# Altium project MB1389.PrjPcb (part 3 of 3)

## Sheet STM32_microcontroller_power.SchDoc: STM32 microcontroller power
size A4; Date: Not used; ApprovedBy: Not used; CheckedBy: Not used; Author: Not used; CompanyName: STMicroelectronics; DrawnBy: Not used; Engineer: Not used; Organization: Not used; Address1: Not used; Address2: Not used; Address3: Not used; Address4: Not used; DocumentNumber: 4; Revision: Not used; SheetNumber: 4; SheetTotal: 8; CurrentTime: Not used; CurrentDate: Not used; Time: Not used; DocumentFullPathAndName: Not used; DocumentName: Not used; ModifiedDate: Not used; ImagePath: Not used; ProjectName: Not used; Application_BuildNumber: Not used
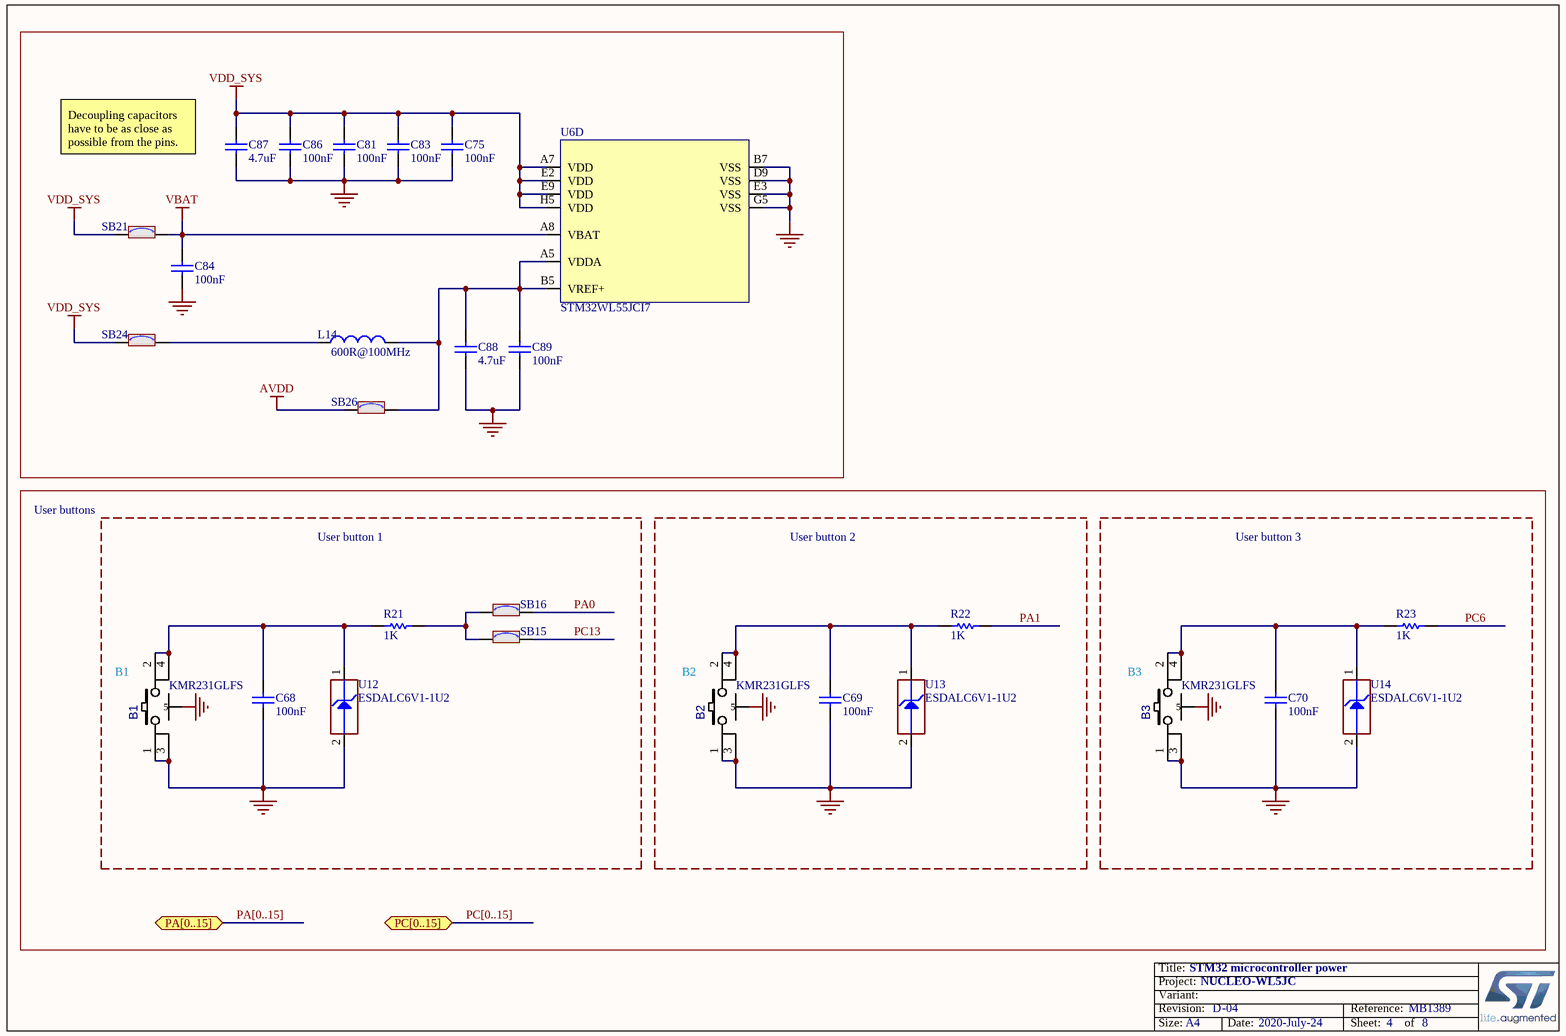
[diagram p7: STM32_microcontroller_power.SchDoc]

### Parts
B1  value KMR231GLFS  [SWI_C&K_Y78B23110FP__ITT_KMR231GLFS]
B2  value KMR231GLFS  [SWI_C&K_Y78B23110FP__ITT_KMR231GLFS]
B3  value KMR231GLFS  [SWI_C&K_Y78B23110FP__ITT_KMR231GLFS]
C68  value 100nF  [C0402]
C69  value 100nF  [C0402]
C70  value 100nF  [C0402]
C75  value 100nF  [C0402]
C81  value 100nF  [C0402]
C83  value 100nF  [C0402]
C84  value 100nF  [C0402]
C86  value 100nF  [C0402]
C87  value 4.7uF  [C0603]
C88  value 4.7uF  [C0603]
C89  value 100nF  [C0402]
L14  value 600R@100MHz  [L0603]
R21  value 1K  [R0402]
R22  value 1K  [R0402]
R23  value 1K  [R0402]
SB15  (no value)  [SOLDER-BRIDGE_R0603-0R]
SB16  (no value)  [SOLDER-BRIDGE_R0603-0R]
SB21  (no value)  [SOLDER-BRIDGE_R0603-0R]
SB24  (no value)  [SOLDER-BRIDGE_R0603-0R]
SB26  (no value)  [SOLDER-BRIDGE_R0603-0R]
U6  value STM32WL55JCI7  [ICC_UFBGA73_5X5_P050]  (part D of 5)
U12  value ESDALC6V1-1U2  [ESD_ST0201]
U13  value ESDALC6V1-1U2  [ESD_ST0201]
U14  value ESDALC6V1-1U2  [ESD_ST0201]

### Ports
PA[0..15] (bidir), PC[0..15] (bidir)

### Nets
AVDD: SB26.1
GND: B1.1 B1.3 B1.5 B2.1 B2.3 B2.5 B3.1 B3.3 B3.5 C68.1 C69.1 C70.1 C75.1 C81.1 C83.1 C84.1 C86.1 C87.1 C88.1 C89.1 U6.B7(VSS) U6.D9(VSS) U6.E3(VSS) U6.G5(VSS) U12.2(GND) U13.2(GND) U14.2(GND)
VBAT: C84.2 SB21.2 U6.A8(VBAT)
VDD_SYS: C75.2 C81.2 C83.2 C86.2 C87.2 SB21.1 SB24.1 U6.A7(VDD) U6.E2(VDD) U6.E9(VDD) U6.H5(VDD)
PA0: SB16.2
PA1: R22.2
PC6: R23.2
PC13: SB15.2
NetB1_2: B1.2 B1.4 C68.2 R21.1 U12.1(IO1)
NetB2_2: B2.2 B2.4 C69.2 R22.1 U13.1(IO1)
NetB3_2: B3.2 B3.4 C70.2 R23.1 U14.1(IO1)
NetC88_2: C88.2 C89.2 L14.2 SB26.2 U6.A5(VDDA) U6.B5(VREF+)
NetL14_1: L14.1 SB24.2
NetR21_2: R21.2 SB15.1 SB16.1

### Buses and harness runs
bus PA[0..15] = port PA[0..15]
bus PC[0..15] = port PC[0..15]

### Notes on the sheet
- (near C87) Decoupling capacitors have to be as close as possible from the pins.
- User buttons
- User button 1
- User button 2
- User button 3
- (near B1) B1
- (near B2) B2
- (near B3) B3
- Title:
- Project:
- Size:
- Revision:
- Variant:
- A4
- -
- Date:
- Reference:
- Sheet:
- of

### Library data of the parts
B1-B3 = MCD-01485: Microminiature Tact Switch for SMT - KMR 2 Series - 1.9 mm height; Part_Type: Misc; Manufacturer: C&K; Provided_By: SUBCO; Internal_Part_Number: MCD-01485; Status: Checked; Manufacturer_Part_Number: KMR231GLFS; ComponentLink1Description: Datasheet; ComponentLink1URL: http://tunmcdsvn.tun.st.com/Component_Datasheet_Library/Trunk/Misc/C&K_tactile_switch_KMR_series; ECCN_US: n/a; ECCN_EU: n/a
C68-C70 C75 C81 C83 C84 C86 C89 = MCD-00102: Capacitor, MLCC, 100nF, 16V, X7R, 10%, 0402, T=0,5mm; Manufacturer_Part_Number: CC0402KRX7R7BB104; Manufacturer: YAGEO; Alternate_Manufacturer_Part_Number: GCM155R71C104KA55D; Alternate_Manufacturer: MURATA; Provided_By: SUBCO; ECCN_US: EAR99; ECCN_EU: NEC; Internal_Part_Number: MCD-00102; Status: Released; Package: C0402; ComponentLink1Description: Datasheet; Part_Type: Capacitor; ComponentLink1URL: http://tunmcdsvn.tun.st.com/Component_Datasheet_Library/Trunk/Capacitors/Yageo_Multilayer_Capacitor_X7R_series_100pF_to_22uF
C87 C88 = MCD-00009: Capacitor, MLCC, 4.7uF, 16V, X5R, 10%, 0603, T=0.8mm; Manufacturer_Part_Number: CC0603KRX5R7BB475; Manufacturer: YAGEO; Provided_By: SUBCO; ECCN_US: EAR99; ECCN_EU: NEC; Internal_Part_Number: MCD-00009; ComponentLink1Description: Datasheet; Status: Released; Part_Type: Capacitor; Package: C0603; ComponentLink1URL: http://tunmcdsvn.tun.st.com/Component_Datasheet_Library/Trunk/Capacitors/Yageo_Multilayer_capacitor_X5R_series_100pF_to_100uF
L14 = MCD-00047: SMD Chip ferrite bead, 600R@100MHz +/-25%, 350mA, 500mohm DC, 0603, T=0.8mm; Part_Type: Inductor; Manufacturer_Part_Number: FCM1608KF-601T03; Manufacturer: TAI-TECH; Provided_By: SUBCO; Internal_Part_Number: MCD-00047; Status: Released; ComponentLink1Description: Datasheet; ComponentLink1URL: http://tunmcdsvn.tun.st.com/Component_Datasheet_Library/Trunk/Inductors/TaiTech_Bead_FCM1608_series; ECCN_US: n/a; ECCN_EU: n/a
R21-R23 = MCD-00061: Resistor,1K,0402,1%,1/16W; Manufacturer_Part_Number: RC0402FR-071KL; Manufacturer: YAGEO; Provided_By: SUBCO; ECCN_US: EAR99; ECCN_EU: NEC; Internal_Part_Number: MCD-00061; Status: Released; Part_Type: Resistor; Package: R0402; ComponentLink1Description: Datasheet; ComponentLink1URL: http://tunmcdsvn.tun.st.com/Component_Datasheet_Library/Trunk/Resistors/Yageo_Resistor_RC0402-series
SB15 SB16 SB21 SB24 SB26 = MCD-00071: Solder Bridge ON; Part_Type: Mechanical; Manufacturer_Part_Number: RC0603JR-070RL; Manufacturer: YAGEO; Provided_By: SUBCO; Internal_Part_Number: MCD-00071; Status: Released; Package: SB0603; ComponentLink1Description: Datasheet; ComponentLink1URL: http://tunmcdsvn.tun.st.com/Component_Datasheet_Library/Trunk/Resistors/Yageo_Resistor_RC0603-series; ECCN_US: n/a; ECCN_EU: n/a
U6 = MCD-01435: Multiprotocol Wireless 32-bit MCUwith LPWAN Sub-GHz radio solution; Part_Type: IC; Manufacturer: STMICROELECTRONICS; ECCN_US: tbd; Internal_Part_Number: MCD-01435; Status: Footprint available; Manufacturer_Part_Number: STM32WL55JCI7; Package: UFBGA73; ComponentLink1Description: Datasheet; ComponentLink1URL: http://tunmcdsvn.tun.st.com/Component_Datasheet_Library/Trunk/IC/STM_STM32WL5x; Provided_By: n/a; ECCN_EU: tbd
U12-U14 = MCD-00170: ESD protection 6V1; Part_Type: Diode; Manufacturer: STMICROELECTRONICS; BMS_Part_Number: 9151132; Provided_By: SUBCO with ST control; ECCN_US: EAR99; ECCN_EU: NEC; Internal_Part_Number: MCD-00170; Status: Released; Manufacturer_Part_Number: ESDALC6V1-1U2; ComponentLink1Description: Datasheet; ComponentLink1URL: http://tunmcdsvn.tun.st.com/Component_Datasheet_Library/Trunk/Diodes/STM_ESD_ESDALC6V1-1U2

## Nets that join several sheets
3V3: STLink_V3E_Module (CN16.3), STLink_V3E_PWR (JP1.1 JP9.1 SB1.2 SB32.1), Arduino_extension_connectors (CN6.4 CN7.16 SB25.1)
3V3_STLK: STLink_V3E_Module (7 pins), STLink_V3E_PWR (39 pins)
5V: STLink_V3E_PWR (10 pins), Arduino_extension_connectors (CN6.5 CN7.18)
5V_PWR: STLink_V3E_Module (R9.1), STLink_V3E_PWR (JP7.2 R24.1)
5V_USB_CHGR: STLink_V3E_Module (7 pins), STLink_V3E_PWR (D3.1 JP4.7), Arduino_extension_connectors (CN10.8)
5V_USB_STLK: STLink_V3E_Module (C34.2 U5.1), STLink_V3E_PWR (JP4.1)
5V_VIN: STLink_V3E_PWR (5 pins), Arduino_extension_connectors (R31.2)
AVDD: Arduino_extension_connectors (CN5.8 CN10.7), STM32_microcontroller_power (SB26.1)
E5V: STLink_V3E_PWR (D2.1 JP4.5), Arduino_extension_connectors (CN7.6)
GND: STM32_microcontroller_IOs (11 pins), STLink_V3E_Module (31 pins), STLink_V3E_PWR (79 pins), Arduino_extension_connectors (10 pins), STM32_microcontroller_RF (58 pins), STM32_microcontroller_power (27 pins)
VBAT: Arduino_extension_connectors (CN7.33), STM32_microcontroller_power (C84.2 SB21.2 U6.A8)
VDD_APP: STLink_V3E_PWR (JP9.2 SB32.2), STM32_microcontroller_RF (U3.5 U4.5)
VDD_MCU: STLink_V3E_PWR (5 pins), Arduino_extension_connectors (CN7.5 SB29.1)
VDD_RF: STLink_V3E_PWR (JP2.2 SB28.2), STM32_microcontroller_RF (C35.2 C37.1 SB23.2 U6.A2)
VDD_SYS: STLink_V3E_PWR (JP5.2 SB27.2), STM32_microcontroller_power (11 pins)
VIN: STLink_V3E_PWR (C40.2 U8.3), Arduino_extension_connectors (CN6.8 CN7.24)
ARD_D0_RX: STM32_microcontroller_IOs (SB4.2 SB9.1), Arduino_extension_connectors (CN9.1 CN10.37)
ARD_D1_TX: STM32_microcontroller_IOs (SB2.2 SB7.1), Arduino_extension_connectors (CN9.2 CN10.35)
ARD_PB3: STM32_microcontroller_IOs (SB31.2), Arduino_extension_connectors (CN9.4 CN10.31)
FE_CTRL1: STM32_microcontroller_IOs (U6.F3), Arduino_extension_connectors (CN10.2), STM32_microcontroller_RF (R27.1 U3.6 U4.6)
FE_CTRL2: STM32_microcontroller_IOs (U6.E4), Arduino_extension_connectors (CN10.4), STM32_microcontroller_RF (R28.1)
FE_CTRL3: STM32_microcontroller_IOs (U6.D5), Arduino_extension_connectors (CN10.38), STM32_microcontroller_RF (SB18.2)
LED1: STM32_microcontroller_IOs (R36.1 U6.B4), Arduino_extension_connectors (CN10.28)
LED2: STM32_microcontroller_IOs (R35.1 U6.C4), Arduino_extension_connectors (CN10.26)
LED3: STM32_microcontroller_IOs (R34.1 U6.G4), Arduino_extension_connectors (CN10.30)
PA0: STM32_microcontroller_IOs (U6.D6), Arduino_extension_connectors (CN10.1), STM32_microcontroller_power (SB16.2)
PA1: STM32_microcontroller_IOs (U6.G3), Arduino_extension_connectors (CN10.36), STM32_microcontroller_power (R22.2)
PA4: STM32_microcontroller_IOs (U6.J1), Arduino_extension_connectors (CN5.3 CN10.17)
PA5: STM32_microcontroller_IOs (U6.J2), Arduino_extension_connectors (CN5.6 CN10.11)
PA6: STM32_microcontroller_IOs (U6.F4), Arduino_extension_connectors (CN5.5 CN10.13)
PA7: STM32_microcontroller_IOs (U6.H3), Arduino_extension_connectors (CN5.4 CN10.15)
PA8: STM32_microcontroller_IOs (U6.J3), Arduino_extension_connectors (CN10.16)
PA9: STM32_microcontroller_IOs (U6.E5), Arduino_extension_connectors (CN5.2 CN10.19)
PA10: STM32_microcontroller_IOs (U6.C8), Arduino_extension_connectors (CN7.32 CN8.3)
PA11: STM32_microcontroller_IOs (U6.B9), Arduino_extension_connectors (CN5.9 CN10.5)
PA12: STM32_microcontroller_IOs (U6.A9), Arduino_extension_connectors (CN5.10 CN10.3)
PA13: STM32_microcontroller_IOs (U6.B8), STLink_V3E_Module (CN16.4 R11.1 U16.5), Arduino_extension_connectors (CN7.13)
PA14: STM32_microcontroller_IOs (U6.A4), STLink_V3E_Module (CN16.6 R12.1 U16.4), Arduino_extension_connectors (CN7.15)
PA15: STM32_microcontroller_IOs (U6.B3), STLink_V3E_Module (CN16.10 U16.1), Arduino_extension_connectors (CN7.17)
PB0: Arduino_extension_connectors (SB30.2), STM32_microcontroller_RF (SB20.1 U6.F6)
PB1: STM32_microcontroller_IOs (U6.E7), Arduino_extension_connectors (CN7.28 CN8.1)
PB2: STM32_microcontroller_IOs (U6.D8), Arduino_extension_connectors (CN7.30 CN8.2)
PB4: STM32_microcontroller_IOs (U6.C2), Arduino_extension_connectors (CN7.34 CN8.4)
PB5: STM32_microcontroller_IOs (U6.D2), Arduino_extension_connectors (CN9.5 CN10.29)
PB8: STM32_microcontroller_IOs (U6.D3), Arduino_extension_connectors (CN9.6 CN10.27)
PB10: STM32_microcontroller_IOs (U6.H4), Arduino_extension_connectors (CN9.7 CN10.25)
PB12: STM32_microcontroller_IOs (U6.E6), Arduino_extension_connectors (CN9.3 CN10.33)
PB13: STM32_microcontroller_IOs (U6.D7), Arduino_extension_connectors (CN7.38 CN8.6)
PB14: STM32_microcontroller_IOs (U6.C6), Arduino_extension_connectors (CN7.36 CN8.5)
PC0: STM32_microcontroller_IOs (U6.F2), Arduino_extension_connectors (CN10.14)
PC1: STM32_microcontroller_IOs (U6.F1), Arduino_extension_connectors (CN9.8 CN10.23)
PC2: STM32_microcontroller_IOs (U6.D4), Arduino_extension_connectors (CN5.1 CN10.21)
PC6: STM32_microcontroller_IOs (U6.G2), Arduino_extension_connectors (CN10.12), STM32_microcontroller_power (R23.2)
PC13: STM32_microcontroller_IOs (U6.C7), Arduino_extension_connectors (CN7.23), STM32_microcontroller_power (SB15.2)
PC14: STM32_microcontroller_IOs (SB11.1), Arduino_extension_connectors (CN7.25)
PC15: STM32_microcontroller_IOs (SB14.1), Arduino_extension_connectors (CN7.27)
PH3: STM32_microcontroller_IOs (JP3.1 U6.J5), Arduino_extension_connectors (SB19.1)
T_NRST: STM32_microcontroller_IOs (5 pins), STLink_V3E_Module (CN16.12 R15.1 U10.1), Arduino_extension_connectors (CN6.3 CN7.14)
T_SWO: STM32_microcontroller_IOs (SB8.2), STLink_V3E_Module (CN16.8 R13.1 U16.3)
T_VCP_RX: STM32_microcontroller_IOs (SB5.1 SB10.2), STLink_V3E_Module (CN16.13 R17.2 U15.1)
T_VCP_TX: STM32_microcontroller_IOs (SB3.1 SB6.2), STLink_V3E_Module (CN16.14 R16.1 U15.3)

## Assembly variants
Low-band: not fitted C17 C21 C22 C30 C38 C92 C93 CN2 CN11 CN13 HW7 HW8 HW21 JP2 JP5 JP9 R33 R39 R40 R41 SB2 SB4 SB6 SB8 SB10 SB11 SB14 SB15 SB25; alternate parts C6 -> MCD-01781, C5 -> MCD-01781, L7 -> MCD-02074, L8 -> MCD-01771, C25 -> MCD-01604, C24 -> MCD-01604, L9 -> MCD-01937, L10 -> MCD-01937, L11 -> MCD-02069, L3 -> MCD-02067, L4 -> MCD-01770, L5 -> MCD-02077, L6 -> MCD-01936, L2 -> MCD-02067, C2 -> MCD-01604, C7 -> MCD-01374, C8 -> MCD-01374, C12 -> MCD-01604, C13 -> MCD-01604, C11 -> MCD-01933, C14 -> MCD-01933, C15 -> MCD-01778, C16 -> MCD-01776, C78 -> MCD-01604, C80 -> MCD-01604, C82 -> MCD-01604, C19 -> MCD-02066, C20 -> MCD-01776
High-band: not fitted C17 C30 C38 CN2 CN11 CN13 HW7 HW8 HW21 JP2 JP5 JP9 R33 R39 R40 R41 SB2 SB4 SB6 SB8 SB10 SB11 SB14 SB15 SB25; alternate parts L7 -> MCD-02069, L8 -> MCD-01609, C25 -> MCD-01784, C24 -> MCD-01784, L9 -> MCD-01937, L10 -> MCD-02078, L11 -> MCD-01921, L3 -> MCD-01768, L4 -> MCD-01768, L5 -> MCD-01762, L6 -> MCD-01922, L2 -> MCD-01768, C5 -> MCD-01775, C6 -> MCD-01775, C2 -> MCD-01784, C7 -> MCD-02065, C8 -> MCD-01772, C12 -> MCD-01604, C13 -> MCD-01784, C11 -> MCD-01374, C14 -> MCD-01775, C21 -> MCD-01374, C22 -> MCD-02065, C15 -> MCD-01773, C16 -> MCD-01774, C78 -> MCD-01784, C80 -> MCD-01784, C82 -> MCD-01784, C19 -> MCD-01774, C20 -> MCD-01776, C92 -> MCD-02065, C93 -> MCD-01775